# Altium schematic sheet PCB1.SchDoc
size A4
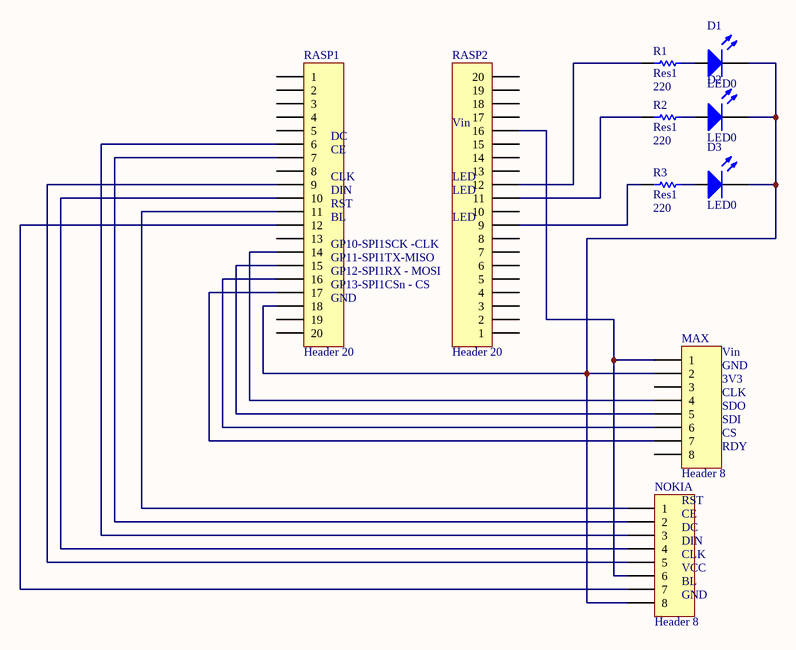
[diagram p0: PCB1.SchDoc]

## Parts
D1  LED0  [LED-0]
D2  LED0  [LED-0]
D3  LED0  [LED-0]
MAX  Header 8  [HDR1X8]
NOKIA  Header 8  [HDR1X8]
R1  Res1  value 220  [AXIAL-0.3]
R2  Res1  value 220  [AXIAL-0.3]
R3  Res1  value 220  [AXIAL-0.3]
RASP1  Header 20  [HDR1X20]
RASP2  Header 20  [HDR1X20]

## Nets
NetD1_1: D1.1(A) R1.2
NetD1_2: D1.2(K) D2.2(K) D3.2(K) MAX.2 NOKIA.8 RASP1.18
NetD2_1: D2.1(A) R2.2
NetD3_1: D3.1(A) R3.2
NetMAX_1: MAX.1 NOKIA.6 RASP2.16
NetMAX_4: MAX.4 RASP1.14
NetMAX_5: MAX.5 RASP1.15
NetMAX_6: MAX.6 RASP1.16
NetMAX_7: MAX.7 RASP1.17
NetNOKIA_1: NOKIA.1 RASP1.11
NetNOKIA_2: NOKIA.2 RASP1.7
NetNOKIA_3: NOKIA.3 RASP1.6
NetNOKIA_4: NOKIA.4 RASP1.10
NetNOKIA_5: NOKIA.5 RASP1.9
NetNOKIA_7: NOKIA.7 RASP1.12
NetR1_1: R1.1 RASP2.12
NetR2_1: R2.1 RASP2.11
NetR3_1: R3.1 RASP2.9

Not connected (* = marked no-connect by the designer): MAX 3 8; RASP1 1 2 3 4 5 8 13 19 20; RASP2 1 2 3 4 5 6 7 8 10 13 14 15 17 18 19 20

## Notes on the sheet
- (near RASP1) DC
- (near RASP2) Vin
- (near RASP1) RST
- (near RASP1) DIN
- (near RASP1) CLK
- (near RASP1) CE
- (near RASP2) LED
- (near RASP1) GP11-SPI1TX-MISO
- (near RASP1) BL
- (near RASP1) GP12-SPI1RX - MOSI
- (near RASP1) GP10-SPI1SCK -CLK
- (near RASP1) GND
- (near RASP1) GP13-SPI1CSn - CS
- (near MAX) Vin
- (near MAX) GND
- (near MAX) 3V3
- (near MAX) CLK
- (near MAX) SDO
- (near MAX) SDI
- (near MAX) CS
- (near MAX) RDY
- (near NOKIA) DC
- RST
- (near NOKIA) CE
- (near NOKIA) DIN
- (near NOKIA) GND
- (near NOKIA) CLK
- (near NOKIA) VCC
- (near NOKIA) BL

## Library data of the parts
D1-D3 = LED0: Typical INFRARED GaAs LED; Published: 8-Jun-2000; LatestRevisionDate: 08-Jul-2005; LatestRevisionNote: Mech Layer 1 removed.; PackageReference: LED-0; Publisher: Altium Limited; PackageDescription: LED; 2 Leads
MAX NOKIA = Header 8: Header, 8-Pin; LatestRevisionDate: 17-Jul-2002; LatestRevisionNote: Re-released for DXP Platform.; Publisher: Altium Limited
R1-R3 = Res1: Resistor; Published: 8-Jun-2000; LatestRevisionDate: 17-Jul-2002; LatestRevisionNote: Re-released for DXP Platform.; PackageReference: AXIAL-0.3; Publisher: Altium Limited; PackageDescription: Axial Device, Thru-Hole; 2 Leads; 0.3 in Pin Spacing
RASP1 RASP2 = Header 20: Header, 20-Pin; LatestRevisionDate: 17-Jul-2002; LatestRevisionNote: Re-released for DXP Platform.; Publisher: Altium Limited